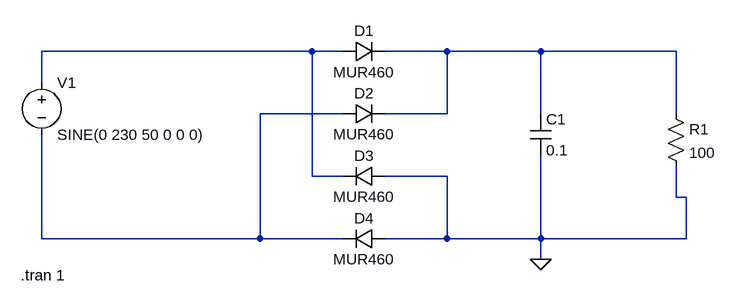
[diagram p0: schematic Brueckengleichrichter.asc]
Brueckengleichrichter.asc, the LTspice schematic file:
Version 4
SHEET 1 880 680
WIRE 192 64 -224 64
WIRE 240 64 192 64
WIRE 400 64 304 64
WIRE 544 64 400 64
WIRE 752 64 544 64
WIRE -224 112 -224 64
WIRE 240 160 112 160
WIRE 400 160 400 64
WIRE 400 160 304 160
WIRE 544 160 544 64
WIRE 752 160 752 64
WIRE 192 256 192 64
WIRE 240 256 192 256
WIRE 400 256 304 256
WIRE 752 288 752 240
WIRE 768 288 752 288
WIRE -224 352 -224 192
WIRE 112 352 112 160
WIRE 112 352 -224 352
WIRE 240 352 112 352
WIRE 400 352 400 256
WIRE 400 352 304 352
WIRE 544 352 544 224
WIRE 544 352 400 352
WIRE 768 352 768 288
WIRE 768 352 544 352
WIRE 544 384 544 352
FLAG 544 384 0
SYMBOL diode 240 80 R270
WINDOW 0 32 32 VTop 2
WINDOW 3 0 32 VBottom 2
SYMATTR InstName D1
SYMATTR Value MUR460
SYMBOL diode 240 176 R270
WINDOW 0 32 32 VTop 2
WINDOW 3 0 32 VBottom 2
SYMATTR InstName D2
SYMATTR Value MUR460
SYMBOL diode 304 240 R90
WINDOW 0 0 32 VBottom 2
WINDOW 3 32 32 VTop 2
SYMATTR InstName D3
SYMATTR Value MUR460
SYMBOL diode 304 336 R90
WINDOW 0 0 32 VBottom 2
WINDOW 3 32 32 VTop 2
SYMATTR InstName D4
SYMATTR Value MUR460
SYMBOL voltage -224 96 R0
WINDOW 123 0 0 Left 2
WINDOW 39 0 0 Left 2
SYMATTR InstName V1
SYMATTR Value SINE(0 230 50 0 0 0)
SYMBOL cap 528 160 R0
SYMATTR InstName C1
SYMATTR Value 0.1
SYMATTR SpiceLine V=500 Irms=3.11 Rser=0.0225901 Lser=0
SYMBOL res 736 144 R0
SYMATTR InstName R1
SYMATTR Value 100
SYMATTR SpiceLine tol=1 pwr=0.1
TEXT -256 408 Left 2 !.tran 1

The netlist it stands for:
* Brueckengleichrichter.asc
D1 N001 N002 MUR460
D2 N003 N002 MUR460
D3 0 N001 MUR460
D4 0 N003 MUR460
V1 N001 N003 SINE(0 230 50 0 0 0)
C1 N002 0 0.1 V=500 Irms=3.11 Rser=0.0225901 Lser=0
R1 N002 0 100 tol=1 pwr=0.1
.model D D
.lib standard.dio
.tran 1
.backanno
.end